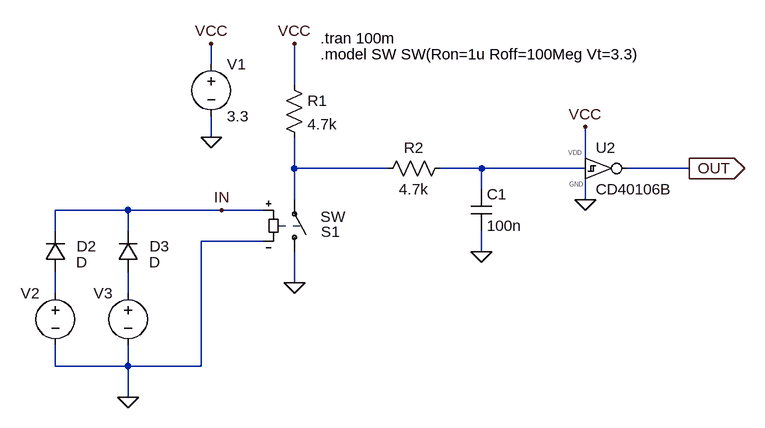
[diagram p0: schematic v2.0.asc]
v2.0.asc, the LTspice schematic file:
Version 4.1
SHEET 1 1212 680
WIRE 176 32 176 0
WIRE 304 64 304 0
WIRE 176 144 176 112
WIRE 752 176 752 128
WIRE 304 192 304 144
WIRE 448 192 304 192
WIRE 592 192 528 192
WIRE 752 192 592 192
WIRE 912 192 816 192
WIRE 592 224 592 192
WIRE 304 240 304 192
WIRE 752 240 752 208
WIRE 48 256 -64 256
WIRE 192 256 48 256
WIRE 256 256 192 256
WIRE -64 288 -64 256
WIRE 48 288 48 256
WIRE 256 304 160 304
WIRE 592 320 592 288
WIRE 304 368 304 320
WIRE -64 384 -64 352
WIRE 48 384 48 352
WIRE -64 496 -64 464
WIRE 48 496 48 464
WIRE 48 496 -64 496
WIRE 160 496 160 304
WIRE 160 496 48 496
WIRE 48 544 48 496
FLAG 176 144 0
FLAG 912 192 OUT
IOPIN 912 192 Out
FLAG 192 256 IN
FLAG 304 368 0
FLAG 592 320 0
FLAG 48 544 0
FLAG 176 0 VCC
FLAG 304 0 VCC
FLAG 752 128 VCC
FLAG 752 240 0
SYMBOL sw 304 336 M180
WINDOW 0 41 47 Left 2
WINDOW 3 40 70 Left 2
SYMATTR InstName S1
SYMBOL res 288 48 R0
SYMATTR InstName R1
SYMATTR Value 4.7k
SYMBOL voltage 176 16 R0
WINDOW 123 0 0 Left 0
WINDOW 39 0 0 Left 0
SYMATTR InstName V1
SYMATTR Value 3.3
SYMBOL voltage 48 368 M0
WINDOW 3 41 64 Invisible 2
WINDOW 123 0 0 Left 0
WINDOW 39 0 0 Left 0
SYMATTR Value PULSE(0 5 15m 1n 1n 250u 500u 10)
SYMATTR InstName V3
SYMBOL voltage -64 368 M0
WINDOW 3 41 64 Invisible 2
WINDOW 123 0 0 Left 0
WINDOW 39 39 69 Left 2
SYMATTR Value PULSE(0 5 20m 1n 1n 30m 80m 1)
SYMATTR InstName V2
SYMBOL cap 576 224 R0
SYMATTR InstName C1
SYMATTR Value 100n
SYMATTR SpiceLine Rser=0.05
SYMBOL diode -80 352 M180
WINDOW 0 49 40 Left 2
WINDOW 3 48 16 Left 2
SYMATTR InstName D2
SYMBOL diode 32 352 M180
WINDOW 0 49 40 Left 2
WINDOW 3 48 16 Left 2
SYMATTR InstName D3
SYMBOL res 544 176 R90
WINDOW 0 0 56 VBottom 2
WINDOW 3 32 56 VTop 2
SYMATTR InstName R2
SYMATTR Value 4.7k
SYMBOL MyLib\\Digital\\CD40106B 752 160 R0
SYMATTR InstName U2
TEXT 344 -8 Left 2 !.tran 100m
TEXT 344 16 Left 2 !.model SW SW(Ron=1u Roff=100Meg Vt=3.3)

The netlist it stands for:
* v2.0.asc
S1 0 N001 IN 0 SW
R1 VCC N001 4.7k
V1 VCC 0 3.3
V3 N004 0 PULSE(0 5 15m 1n 1n 250u 500u 10)
V2 N003 0 PULSE(0 5 20m 1n 1n 30m 80m 1)
C1 N002 0 100n Rser=0.05
D2 N003 IN D
D3 N004 IN D
R2 N002 N001 4.7k
X§U2 N002 OUT VCC 0 CD40106B vdd=5 speed=2 tripdt=100n  ; pins in out VDD GND
.model D D
.lib standard.dio
.tran 100m
.model SW SW(Ron=1u Roff=100Meg Vt=3.3)
.lib MyLib/Digital/_CD4xxx.lib
.backanno
.end